# EAGLE schematic leddriverv2 (EAGLE 9.4.2)
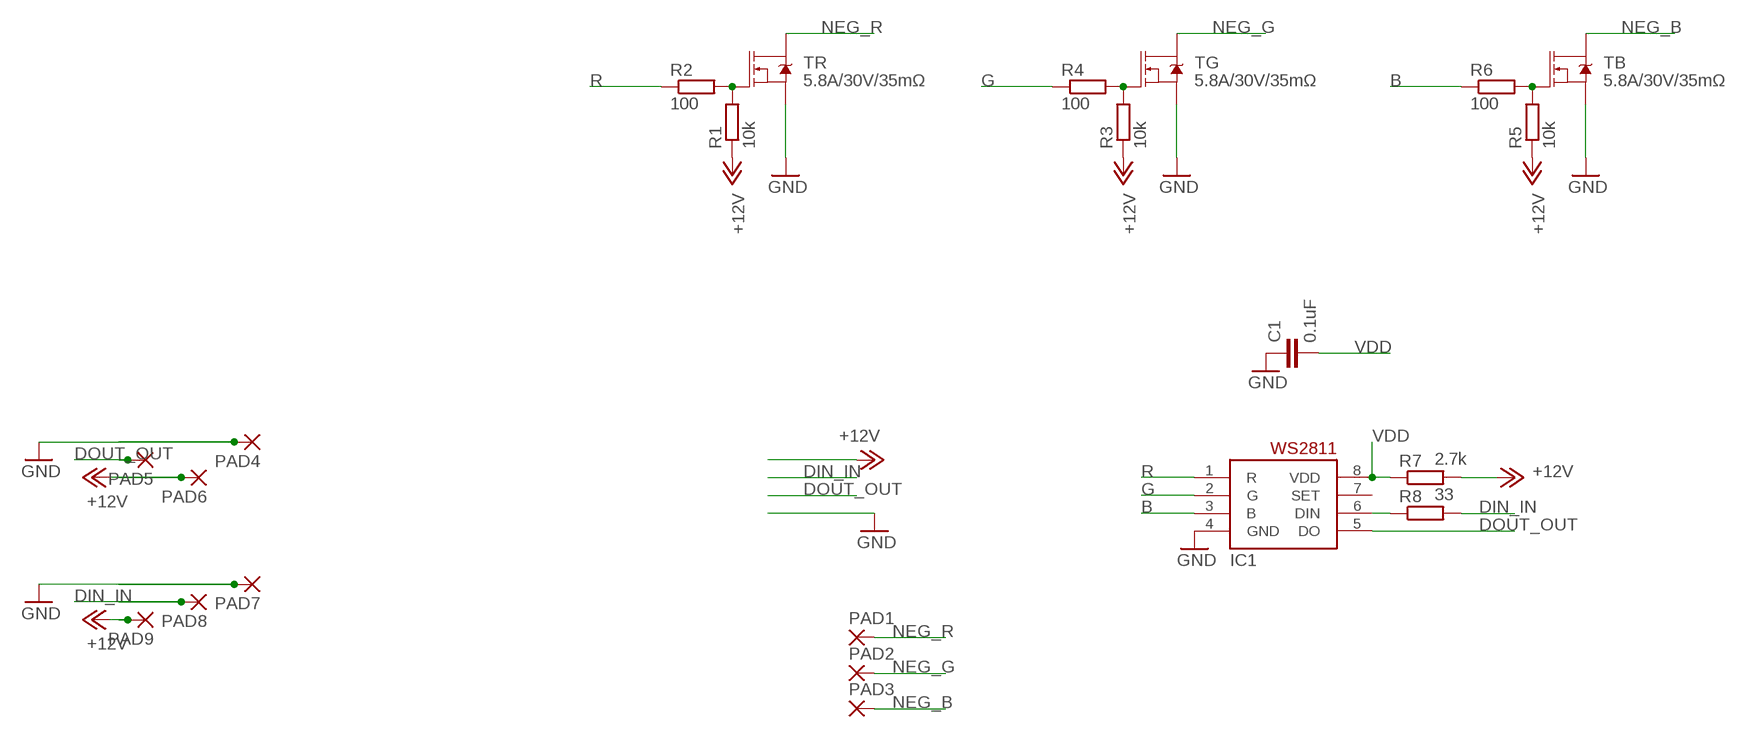
[diagram p0: schematic, sheet 1]

## Parts
C1  0.1uF  C-EUC1206  [C1206]
IC1  WS2811-SOP8  [SO08-SKINNYPADS]
PAD1  3,81/1,4  [3,81/1,4]
PAD2  3,81/1,4  [3,81/1,4]
PAD3  3,81/1,4  [3,81/1,4]
PAD4  2,54/1,1  [2,54/1,1]
PAD5  2,54/1,1  [2,54/1,1]
PAD6  2,54/1,1  [2,54/1,1]
PAD7  2,54/1,1  [2,54/1,1]
PAD8  2,54/1,1  [2,54/1,1]
PAD9  2,54/1,1  [2,54/1,1]
R1  10k  R-EU_R0805  [R0805]
R2  100  R-EU_R0805  [R0805]
R3  10k  R-EU_R0805  [R0805]
R4  100  R-EU_R0805  [R0805]
R5  10k  R-EU_R0805  [R0805]
R6  100  R-EU_R0805  [R0805]
R7  2.7k  R-EU_R0805  [R0805]
R8  33  R-EU_R0805  [R0805]
TB  5.8A/30V/35mΩ  MOSFET-NCH-AO3404A  [SOT23-3]
TG  5.8A/30V/35mΩ  MOSFET-NCH-AO3404A  [SOT23-3]
TR  5.8A/30V/35mΩ  MOSFET-NCH-AO3404A  [SOT23-3]

## Nets
+12V: PAD6.1(P) PAD9.1(P) R1.1 R3.1 R5.1 R7.2
B: IC1.3(B) R6.1
DIN_IN: PAD8.1(P) R8.2
DOUT_OUT: IC1.5(DO) PAD5.1(P)
G: IC1.2(G) R4.1
GND: C1.1 IC1.4(GND) PAD4.1(P) PAD7.1(P) TB.2(S) TG.2(S) TR.2(S)
N$1: IC1.6(DIN) R8.1
N$2: R3.2 R4.2 TG.1(G)
N$3: R5.2 R6.2 TB.1(G)
N$4: R1.2 R2.2 TR.1(G)
NEG_B: PAD3.1(P) TB.3(D)
NEG_G: PAD2.1(P) TG.3(D)
NEG_R: PAD1.1(P) TR.3(D)
R: IC1.1(R) R2.1
VDD: C1.2 IC1.8(VDD) R7.1
Unconnected: IC1.7(SET)

## Library data of the parts
C1 = rcl:C-EU: CAPACITOR, European symbol; SPICEPREFIX: C
IC1 = adafruit_wsled:WS2811
PAD1-PAD3 = wirepad:3,81/1,4: THROUGH-HOLE PAD
PAD4-PAD9 = wirepad:2,54/1,1: THROUGH-HOLE PAD
R1-R8 = rcl:R-EU_: RESISTOR, European symbol; SPICEPREFIX: R
TB TG TR = SparkFun-DiscreteSemi:MOSFET-NCH: N-channel MOSFETs Voltage controlled devices that allow control of high current outputs. SparkFun Products: SparkFun OpenScale <https://www.sparkfun.com/products/13261> SparkFun Digital Sandbox <https://www.sparkfun.com/products/12651> SparkFun Monster Moto Shield <https://www.sparkfun.com/products/10182> SparkFun MOSFET Power Controller <https://www.sparkfun.com/products/11214>; PROD_ID: TRANS-12988